# EAGLE design dotklok_rev_1-1 (EAGLE 5.10)
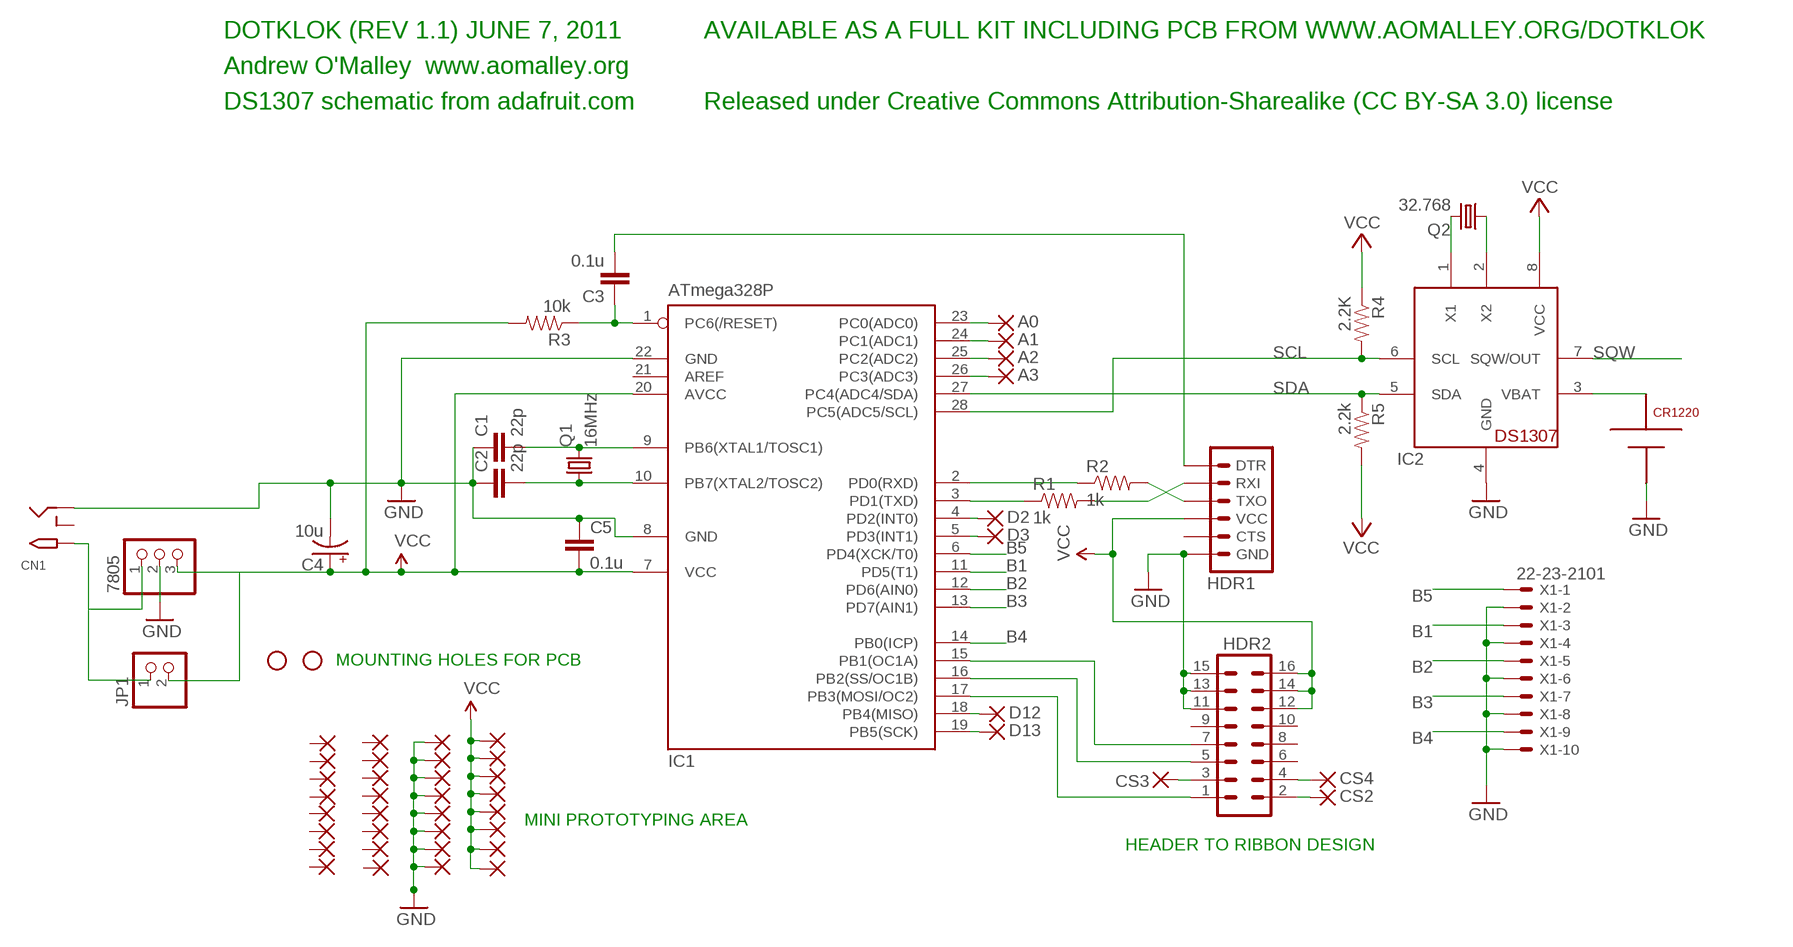
[diagram p0: schematic, sheet 1]

## Parts
7805  PINHD-1X3  [1X03]
A0  2,15/1,0  [2,15/1,0]
A1  2,15/1,0  [2,15/1,0]
A2  2,15/1,0  [2,15/1,0]
A3  2,15/1,0  [2,15/1,0]
C1  22p  CAPPTH  [CAP-PTH-SMALL]
C2  22p  CAPPTH  [CAP-PTH-SMALL]
C3  0.1u  CAPPTH  [CAP-PTH-SMALL]
C4  10u  CAP_POLPTH2  [CPOL-RADIAL-10UF-25V]
C5  0.1u  CAPPTH  [CAP-PTH-SMALL]
CN1  2.1MMJACKTHM  [PJ-102A]
CS2  2,15/1,0  [2,15/1,0]
CS3  2,15/1,0  [2,15/1,0]
CS4  2,15/1,0  [2,15/1,0]
D2  2,15/1,0  [2,15/1,0]
D3  2,15/1,0  [2,15/1,0]
D12  2,15/1,0  [2,15/1,0]
D13  2,15/1,0  [2,15/1,0]
HDR1  ARDUINO_SERIAL_PROGRAMPTH  [1X06]
HDR2  MA08-2  [MA08-2]
IC1  ATmega328P  MEGA8-P  [DIL28-3]
IC2  DS1307  [DIL08]
JP1  PINHD-1X2  [1X02]
JP5  STAND-OFF  [STAND-OFF]
JP6  STAND-OFF  [STAND-OFF]
PAD1  2,15/1,0  [2,15/1,0]
PAD2  2,15/1,0  [2,15/1,0]
PAD3  2,15/1,0  [2,15/1,0]
PAD4  2,15/1,0  [2,15/1,0]
PAD5  2,15/1,0  [2,15/1,0]
PAD6  2,15/1,0  [2,15/1,0]
PAD7  2,15/1,0  [2,15/1,0]
PAD8  2,15/1,0  [2,15/1,0]
PAD9  2,15/1,0  [2,15/1,0]
PAD10  2,15/1,0  [2,15/1,0]
PAD11  2,15/1,0  [2,15/1,0]
PAD12  2,15/1,0  [2,15/1,0]
PAD13  2,15/1,0  [2,15/1,0]
PAD14  2,15/1,0  [2,15/1,0]
PAD15  2,15/1,0  [2,15/1,0]
PAD16  2,15/1,0  [2,15/1,0]
PAD17  2,15/1,0  [2,15/1,0]
PAD18  2,15/1,0  [2,15/1,0]
PAD19  2,15/1,0  [2,15/1,0]
PAD20  2,15/1,0  [2,15/1,0]
PAD21  2,15/1,0  [2,15/1,0]
PAD22  2,15/1,0  [2,15/1,0]
PAD23  2,15/1,0  [2,15/1,0]
PAD24  2,15/1,0  [2,15/1,0]
PAD25  2,15/1,0  [2,15/1,0]
PAD26  2,15/1,0  [2,15/1,0]
PAD27  2,15/1,0  [2,15/1,0]
PAD28  2,15/1,0  [2,15/1,0]
PAD29  2,15/1,0  [2,15/1,0]
PAD30  2,15/1,0  [2,15/1,0]
PAD31  2,15/1,0  [2,15/1,0]
PAD32  2,15/1,0  [2,15/1,0]
Q1  16MHz  CRYSTALHC49US  [HC49US]
Q2  32.768  CRYTALTC38H  [TC38H]
R1  1k  RESISTORPTH1  [AXIAL-0.3]
R2  1k  RESISTORPTH1  [AXIAL-0.3]
R3  10k  RESISTORPTH1  [AXIAL-0.3]
R4  2.2K  RESISTORPTH1  [AXIAL-0.3]
R5  2.2k  RESISTORPTH1  [AXIAL-0.3]
U$1  CR1220_THM  [CR1220_THM]
X1  22-23-2101  [22-23-2101]

## Nets
B1: IC1.11(PD5(T1)) X1.3
B2: IC1.12(PD6(AIN0)) X1.5
B3: IC1.13(PD7(AIN1)) X1.7
B4: IC1.14(PB0(ICP)) X1.9
B5: IC1.6(PD4(XCK/T0)) X1.1
GND: 7805.2 C1.1 C2.1 C4.2(-) C5.1 CN1.RING HDR1.6(GND) HDR2.11 HDR2.13 HDR2.15 IC1.8(GND) IC1.22(GND) IC2.4(GND) PAD7.1(P) PAD8.1(P) PAD9.1(P) PAD10.1(P) PAD11.1(P) PAD12.1(P) PAD21.1(P) PAD22.1(P) U$1.GND(NEG) X1.2 X1.4 X1.6 X1.8 X1.10
N$1: C1.2 IC1.9(PB6(XTAL1/TOSC1)) Q1.2
N$2: C2.2 IC1.10(PB7(XTAL2/TOSC2)) Q1.1
N$3: IC1.2(PD0(RXD)) R2.P$1
N$4: IC1.3(PD1(TXD)) R1.P$1
N$5: C3.1 IC1.1(PC6(/RESET)) R3.P$1
N$6: HDR1.2(RXI) R1.P$2
N$7: C3.2 HDR1.1(DTR)
N$8: HDR1.3(TXO) R2.P$2
N$9: HDR2.1 IC1.17(PB3(MOSI/OC2))
N$10: A0.1(P) IC1.23(PC0(ADC0))
N$11: HDR2.5 IC1.16(PB2(SS/OC1B))
N$12: IC2.3(VBAT) U$1.+(POS)
N$13: A1.1(P) IC1.24(PC1(ADC1))
N$14: IC2.1(X1) Q2.2
N$15: IC2.2(X2) Q2.1
N$16: A2.1(P) IC1.25(PC2(ADC2))
N$17: HDR2.7 IC1.15(PB1(OC1A))
N$18: A3.1(P) IC1.26(PC3(ADC3))
N$19: D2.1(P) IC1.4(PD2(INT0))
N$20: D3.1(P) IC1.5(PD3(INT1))
N$21: D12.1(P) IC1.18(PB4(MISO))
N$22: D13.1(P) IC1.19(PB5(SCK))
N$24: CS3.1(P) HDR2.3
N$25: CS4.1(P) HDR2.4
N$26: CS2.1(P) HDR2.2
N$29: 7805.1 CN1.TIP JP1.1
SCL: IC1.28(PC5(ADC5/SCL)) IC2.6(SCL) R4.P$2
SDA: IC1.27(PC4(ADC4/SDA)) IC2.5(SDA) R5.P$1
SQW: IC2.7(SQW/OUT)
VCC: 7805.3 C4.1(+) C5.2 HDR1.4(VCC) HDR2.12 HDR2.14 HDR2.16 IC1.7(VCC) IC1.20(AVCC) IC2.8(VCC) JP1.2 PAD13.1(P) PAD14.1(P) PAD15.1(P) PAD16.1(P) PAD17.1(P) PAD18.1(P) PAD23.1(P) PAD24.1(P) R3.P$2 R4.P$1 R5.P$2
Unconnected: CN1.RING_SW HDR1.5(CTS) HDR2.6 HDR2.8 HDR2.9 HDR2.10 IC1.21(AREF) PAD1.1(P) PAD2.1(P) PAD3.1(P) PAD4.1(P) PAD5.1(P) PAD6.1(P) PAD19.1(P) PAD20.1(P) PAD25.1(P) PAD26.1(P) PAD27.1(P) PAD28.1(P) PAD29.1(P) PAD30.1(P) PAD31.1(P) PAD32.1(P)

## Notes on the sheet
- DOTKLOK (REV 1.1) JUNE 7, 2011 | AVAILABLE AS A FULL KIT INCLUDING PCB FROM WWW.AOMALLEY.ORG/DOTKLOK
- Andrew O'Malley  www.aomalley.org
- DS1307 schematic from adafruit.com | Released under Creative Commons Attribution-Sharealike (CC BY-SA 3.0) license
- MOUNTING HOLES FOR PCB
- MINI PROTOTYPING AREA
- HEADER TO RIBBON DESIGN

## Library data of the parts
7805 = pinhead_ao:PINHD-1X3: PIN HEADER
A0 A1-A3 CS2-CS4 D2 D3 D12 D13 PAD1-PAD32 = wirepad:2,15/1,0: THROUGH-HOLE PAD
C1-C3 C5 = SparkFun:CAP: Capacitor Standard 0603 ceramic capacitor, and 0.1" leaded capacitor.
C4 = SparkFun:CAP_POL: Capacitor Polarized These are standard SMD and PTH capacitors. Normally 10uF, 47uF, and 100uF in electrolytic and tantalum varieties. Always verify the external diameter of the through hole cap, it varies with capacity, voltage, and manufacturer. The EIA devices should be standard.
CN1 = adafruit:2.1MMJACK: 2.1mm x 5.5mm THM DC jack with internal switch. Digikey part #PJ-102A, 4UCON part #05537 2.1mm x 5.5mm SMT DC jack with internal switch. Digikey part #PJ-002A-SMT, 4UCON part #03267 By microbuilder.eu & adafruit.com
HDR1 = SparkFun:ARDUINO_SERIAL_PROGRAM
HDR2 = con-lstb:MA08-2: PIN HEADER
IC1 = atmel:MEGA8-P: MICROCONTROLLER 8 Kbytes FLASH, 1 kbytes SRAM, 512 bytes EEPROM, USART, 4-channel 10 bit ADC, 2-channel 8 bit ADC Pin compatible with Atmega48, ATMega88, ATMega168 Source: avr.lbr
IC2 = adafruit:DS1307: DS1307 Real time clock (RTC) with battery backup ability. Talk to it via i2c
JP1 = pinhead:PINHD-1X2: PIN HEADER
JP5 JP6 = SparkFun:STAND-OFF: Stand Off This is the mechanical footprint for a #4 phillips button head screw. Use the keepout ring to avoid running the screw head into surrounding components. SKU : PRT-00447
Q1 = SparkFun:CRYSTAL: Crystals Various standard crystals. Proven footprints. Spark Fun Electronics SKU : COM-00534
Q2 = crystal:CRYTAL: CRYSTAL
R1-R5 = SparkFun:RESISTOR: Resistor Basic schematic elements and footprints for 0603, 1206, and PTH 1/10th watt (small) resistors.
U$1 = AO_dotklok:CR1220_THM: CR1220 coin cell holder, Mouser.com part # 534-500
X1 = con-molex:22-23-2101: .100" (2.54mm) Center Header - 10 Pin

## Board
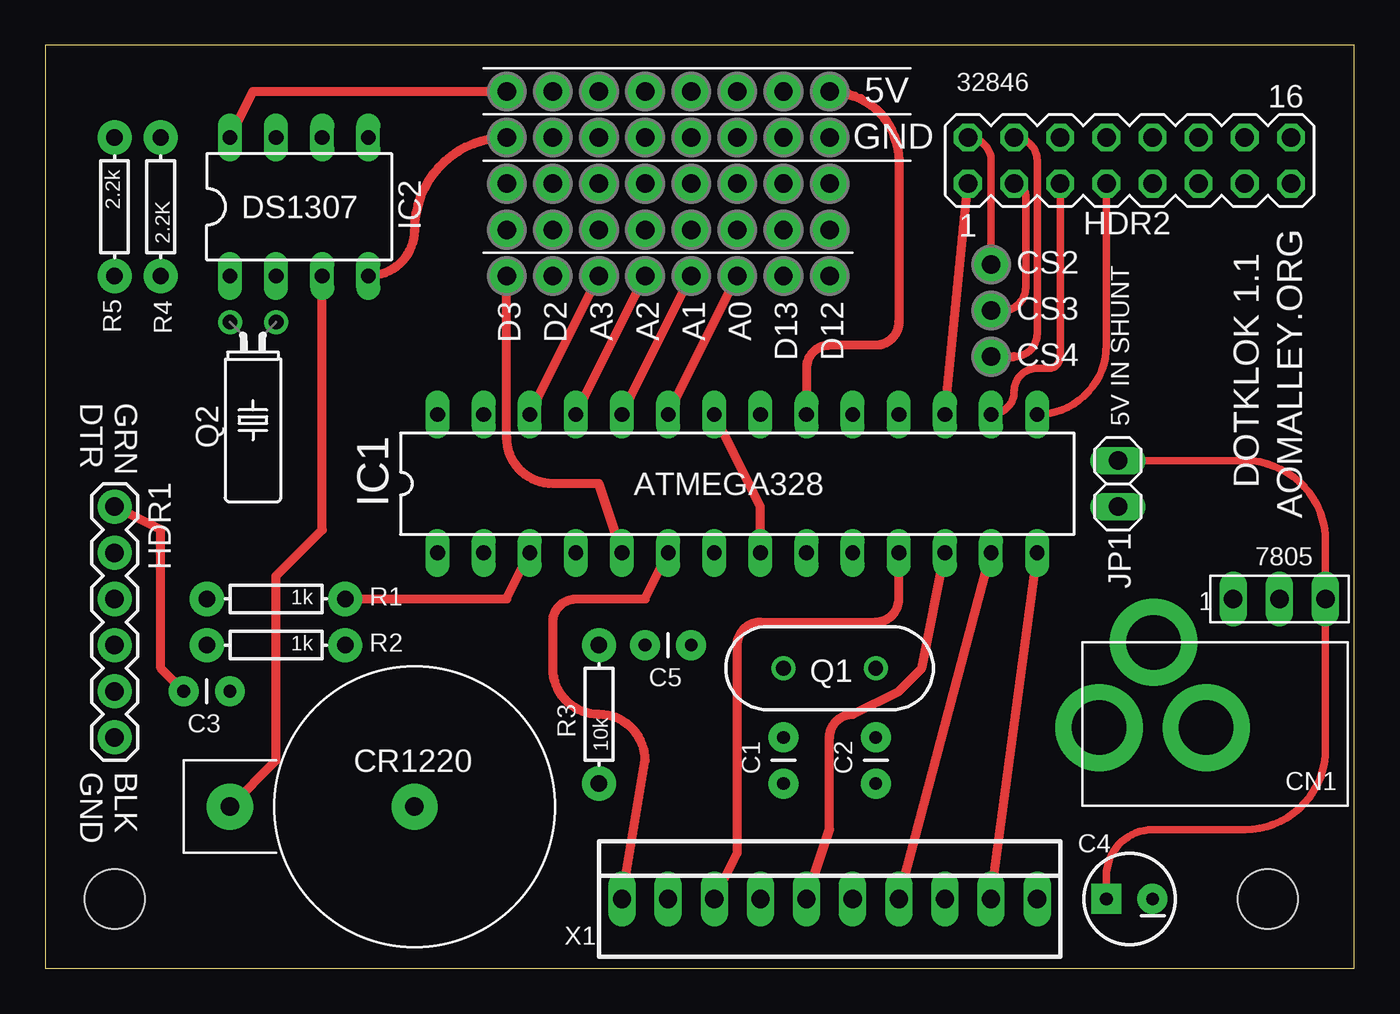
[diagram p1: board, top side]
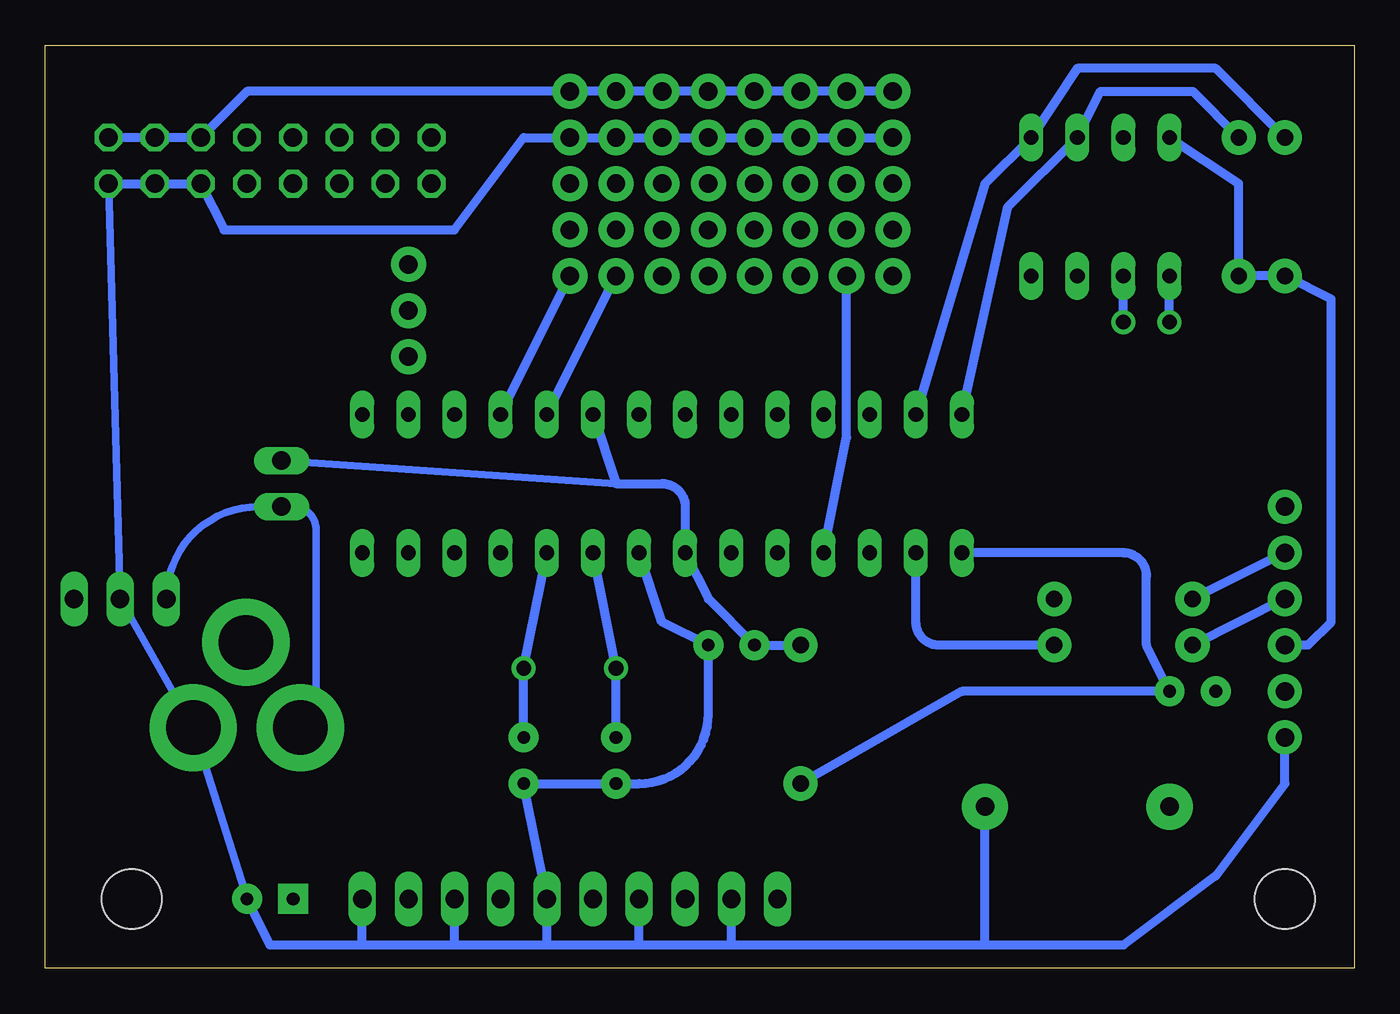
[diagram p2: board, bottom side, seen from below]

Size 72.06 x 50.79 mm. Coordinates in mm from the lower left corner, seen from the top.
Outline: 0,0 72.06,0 72.06,50.79 0,50.79 0,0
Copper layers (1*16): Top 0.035mm / dielectric 1.5mm / Bottom 0.035mm
Design rules "Fusion_eagle_rule_v1.1": minimum track width 6mil, minimum drill 12mil, track to track 6mil, track to pad 6mil, pad to pad 6mil, via to via 6mil, smd to smd 0mil, copper to edge 10mil, drill to drill 10mil, minimum pad ring 10mil, minimum via ring 6mil, stop-mask expansion 2mil, vias tented up to drill 100mil, thermal gap 10mil

### Footprints (pad centres in the part's own frame; a part is rotated, then mirrored left to right if it is on the bottom)
1X03 = drill 1.016 long: 1 -2.54,0; 2 0,0; 3 2.54,0
2,15/1,0 = drill 1.016 pad 1.93 round: 1 0,0
CAP-PTH-SMALL = drill 0.7 pad 1.651 round: 1 0,0; 2 2.54,0
CPOL-RADIAL-10UF-25V = drill 0.7 pad 1.651 square: 1 1.27,0 | drill 0.7 pad 1.651 round: 2 -1.27,0
PJ-102A = drill 3 pad 4.8 round: RING 0.1,-3.39; RING_SW -4.6,-6.29; TIP 0.1,-9.29
1X06 = drill 1.016 pad 1.88 round: 1 0,0; 2 2.54,0; 3 5.08,0; 4 7.62,0; 5 10.16,0; 6 12.7,0
MA08-2 = drill 1.016 octagon: 1 -8.89,-1.27; 2 -8.89,1.27; 3 -6.35,-1.27; 4 -6.35,1.27; 5 -3.81,-1.27; 6 -3.81,1.27; 7 -1.27,-1.27; 8 -1.27,1.27; 9 1.27,-1.27; 10 1.27,1.27; 11 3.81,-1.27; 12 3.81,1.27; 13 6.35,-1.27; 14 6.35,1.27; 15 8.89,-1.27; 16 8.89,1.27
DIL28-3 = drill 0.813 long: 1 -16.51,-3.81; 2 -13.97,-3.81; 3 -11.43,-3.81; 4 -8.89,-3.81; 5 -6.35,-3.81; 6 -3.81,-3.81; 7 -1.27,-3.81; 8 1.27,-3.81; 9 3.81,-3.81; 10 6.35,-3.81; 11 8.89,-3.81; 12 11.43,-3.81; 13 13.97,-3.81; 14 16.51,-3.81; 15 16.51,3.81; 16 13.97,3.81; 17 11.43,3.81; 18 8.89,3.81; 19 6.35,3.81; 20 3.81,3.81; 21 1.27,3.81; 22 -1.27,3.81; 23 -3.81,3.81; 24 -6.35,3.81; 25 -8.89,3.81; 26 -11.43,3.81; 27 -13.97,3.81; 28 -16.51,3.81
DIL08 = drill 0.813 long: 1 -3.81,-3.81; 2 -1.27,-3.81; 3 1.27,-3.81; 4 3.81,-3.81; 5 3.81,3.81; 6 1.27,3.81; 7 -1.27,3.81; 8 -3.81,3.81
1X02 = drill 1.016 long: 1 -1.27,0; 2 1.27,0
STAND-OFF = hole 3.302: 0,0
HC49US = drill 0.813 round: 1 -2.54,0; 2 2.54,0
TC38H = drill 0.813 round: 1 -1.27,0; 2 1.27,0
AXIAL-0.3 = drill 0.9 pad 1.88 round: P$1 -3.81,0; P$2 3.81,0
CR1220_THM = drill 1.016 pad 2.54 round: + 10.16,0; GND 0,0
22-23-2101 = drill 1 long: 1 -11.43,0; 2 -8.89,0; 3 -6.35,0; 4 -3.81,0; 5 -1.27,0; 6 1.27,0; 7 3.81,0; 8 6.35,0; 9 8.89,0; 10 11.43,0

### Placement (x,y rotation side)
7805  67.94,20.32 0 top
A0  38.1,38.1 270 top
A1  35.56,38.1 270 top
A2  33.02,38.1 270 top
A3  30.48,38.1 270 top
C1  40.64,10.16 90 top
C2  45.72,10.16 90 top
C3  10.16,15.24 180 top
C4  59.69,3.81 180 top
C5  35.56,17.78 180 top
CN1  67.31,13.34 270 top
CS2  52.07,38.73 0 top
CS3  52.07,36.2 0 top
CS4  52.07,33.66 0 top
D2  27.94,38.1 270 top
D3  25.4,38.1 270 top
D12  43.18,38.1 270 top
D13  40.64,38.1 270 top
HDR1  3.81,25.4 270 top
HDR2  59.69,44.45 0 top
IC1  38.1,26.67 0 top
IC2  13.97,41.91 0 top
JP1  59.05,26.67 90 top
JP5  67.31,3.81 0 top
JP6  3.81,3.81 0 top
PAD1  30.48,40.64 0 top
PAD2  33.02,40.64 0 top
PAD3  35.56,40.64 0 top
PAD4  38.1,40.64 0 top
PAD5  40.64,40.64 0 top
PAD6  43.18,40.64 0 top
PAD7  30.48,45.72 0 top
PAD8  33.02,45.72 0 top
PAD9  35.56,45.72 0 top
PAD10  38.1,45.72 0 top
PAD11  40.64,45.72 0 top
PAD12  43.18,45.72 0 top
PAD13  30.48,48.26 0 top
PAD14  33.02,48.26 0 top
PAD15  35.56,48.26 0 top
PAD16  38.1,48.26 0 top
PAD17  40.64,48.26 0 top
PAD18  43.18,48.26 0 top
PAD19  27.94,40.64 0 top
PAD20  25.4,40.64 0 top
PAD21  27.94,45.72 0 top
PAD22  25.4,45.72 0 top
PAD23  27.94,48.26 0 top
PAD24  25.4,48.26 0 top
PAD25  25.4,43.18 0 top
PAD26  27.94,43.18 0 top
PAD27  30.48,43.18 0 top
PAD28  35.56,43.18 0 top
PAD29  33.02,43.18 0 top
PAD30  38.1,43.18 0 top
PAD31  40.64,43.18 0 top
PAD32  43.18,43.18 0 top
Q1  43.18,16.51 180 top
Q2  11.43,35.56 180 top
R1  12.7,20.32 180 top
R2  12.7,17.78 180 top
R3  30.48,13.97 90 top
R4  6.35,41.91 90 top
R5  3.81,41.91 270 top
U$1  20.32,8.89 180 top
X1  43.18,3.81 0 top

### Tracks (layer width: path | path; a pad name or v marks a point on that pad's centre or on a via)
B1
  Top 0.508: X1.3 38.1,6.35 38.1,17.78 arc-90 39.37,19.05 45.72,19.05 arc90 46.99,20.32 IC1.11
B2
  Top 0.508: X1.5 43.18,7.62 43.18,12.7 arc-90 44.45,13.97 46.99,15.24 48.26,16.51 IC1.12
B3
  Top 0.508: X1.7 IC1.13
B4
  Top 0.508: X1.9 IC1.14
B5
  Top 0.508: X1.1 33.02,11.43 arc90 30.48,13.97 arc-90 27.94,16.51 27.94,19.05 arc-90 29.21,20.32 33.02,20.32 IC1.6
GND
  Top 0.508: IC1.8 39.37,25.4 IC1.22 | PAD22.1 arc90 20.32,40.64 arc-90 IC2.4
  Bottom 0.406: C4.2 CN1.RING 7805.2 HDR2.15
  Bottom 0.508: IC1.8 38.1,19.05 C5.1 35.56,13.97 arc90 39.37,10.16 C1.1 C2.1 X1.6 44.45,1.27 | 39.37,1.27 X1.4 | 49.53,1.27 X1.8 | 39.37,1.27 44.45,1.27 | 44.45,1.27 49.53,1.27 | C4.2 59.69,1.27 54.61,1.27 | 49.53,1.27 54.61,1.27 | 54.61,1.27 X1.10 | 34.29,1.27 39.37,1.27 | 34.29,1.27 X1.2 | 20.32,1.27 12.7,1.27 7.62,5.08 3.81,10.16 HDR1.6 | 20.32,1.27 34.29,1.27 | 20.32,1.27 U$1.GND | PAD22.1 PAD21.1 PAD7.1 PAD8.1 PAD9.1 PAD10.1 PAD11.1 PAD12.1 45.72,45.72 49.53,40.64 62.23,40.64 HDR2.11 HDR2.13 HDR2.15
N$1
  Bottom 0.508: IC1.9 Q1.2 C1.2
N$2
  Bottom 0.508: IC1.10 Q1.1 C2.2
N$3
  Bottom 0.508: IC1.2 24.13,19.05 arc-90 22.86,17.78 R2.P$1
N$4
  Top 0.508: R1.P$1 25.4,20.32 IC1.3
N$5
  Bottom 0.508: IC1.1 12.7,22.86 arc90 11.43,21.59 11.43,17.78 C3.1 21.59,15.24 R3.P$1
N$6
  Bottom 0.508: HDR1.2 R1.P$2
N$7
  Top 0.508: C3.2 6.35,16.51 6.35,24.13 HDR1.1
N$8
  Bottom 0.508: HDR1.3 R2.P$2
N$9
  Top 0.508: IC1.17 HDR2.1
N$10
  Top 0.508: IC1.23 A0.1
N$11
  Top 0.406: IC1.16 arc90 53.34,31.75 arc-90 54.61,33.02 55.24,33.02 arc90 55.88,33.66 HDR2.5
N$12
  Top 0.508: IC2.3 15.24,24.13 12.7,21.59 12.7,11.43 U$1.+
N$13
  Top 0.508: IC1.24 A1.1
N$14
  Bottom 0.508: Q2.2 IC2.1
N$15
  Bottom 0.508: Q2.1 IC2.2
N$16
  Top 0.508: IC1.25 A2.1
N$17
  Top 0.406: IC1.15 arc90 58.42,34.29 HDR2.7
N$18
  Top 0.508: IC1.26 A3.1
N$19
  Bottom 0.508: IC1.4 27.94,29.21 D2.1
N$20
  Top 0.508: IC1.5 30.48,26.67 27.94,26.67 arc-90 25.4,29.21 D3.1
N$21
  Bottom 0.508: IC1.18 D12.1
N$22
  Bottom 0.508: IC1.19 D13.1
N$24
  Top 0.406: HDR2.3 arc-90 53.98,42.55 53.98,37.47 arc-90 52.7,36.2 CS3.1
N$25
  Top 0.406: HDR2.4 arc-90 54.61,44.45 54.61,34.92 arc-90 53.34,33.66
  Top 0.508: CS4.1 53.34,33.66
N$26
  Top 0.406: HDR2.2 arc-90 52.07,44.45 CS2.1
N$29
  Bottom 0.406: 7805.1 arc90 60.33,25.4 JP1.1 58.42,25.4 arc90 57.15,24.13 57.15,14.11 arc90 CN1.TIP
SCL
  Bottom 0.508: R4.P$2 8.89,48.26 13.97,48.26 IC2.6 19.05,41.91 IC1.28
SDA
  Bottom 0.508: R5.P$1 7.62,49.53 15.24,49.53 IC2.5 20.32,43.18 IC1.27
VCC
  Top 0.406: JP1.2 66.04,27.94 arc-90 70.48,23.5 7805.3 70.48,12.06 arc-90 66.04,7.62 60.96,7.62 arc90 58.42,5.08 C4.1
  Top 0.508: IC2.8 11.43,48.26 PAD24.1 | IC1.20 41.91,33.02 arc-90 43.18,34.29 45.72,34.29 arc90 46.99,35.56 46.99,44.45 arc90 PAD18.1
  Bottom 0.406: 40.64,26.67 JP1.2
  Bottom 0.508: HDR1.4 2.54,17.78 1.27,19.05 1.27,36.83 R5.P$2 R4.P$1 6.35,43.18 IC2.8 | PAD24.1 PAD23.1 PAD13.1 PAD14.1 PAD15.1 PAD16.1 PAD17.1 PAD18.1 60.96,48.26 HDR2.12 HDR2.14 HDR2.16 | R3.P$2 C5.2 35.56,20.32 IC1.7 36.83,25.4 arc-90 38.1,26.67 40.64,26.67 IC1.20

### Text on the board
tNames: 5V | 32846 | GND | DS1307 | DOTKLOK 1.1 | DTR | GRN | 5V IN SHUNT | ATMEGA328 | AOMALLEY.ORG | 1 | GND | BLK | CN1 | Released under Creative Commons Attribution-Sharealike (CC BY-SA 3.0) license